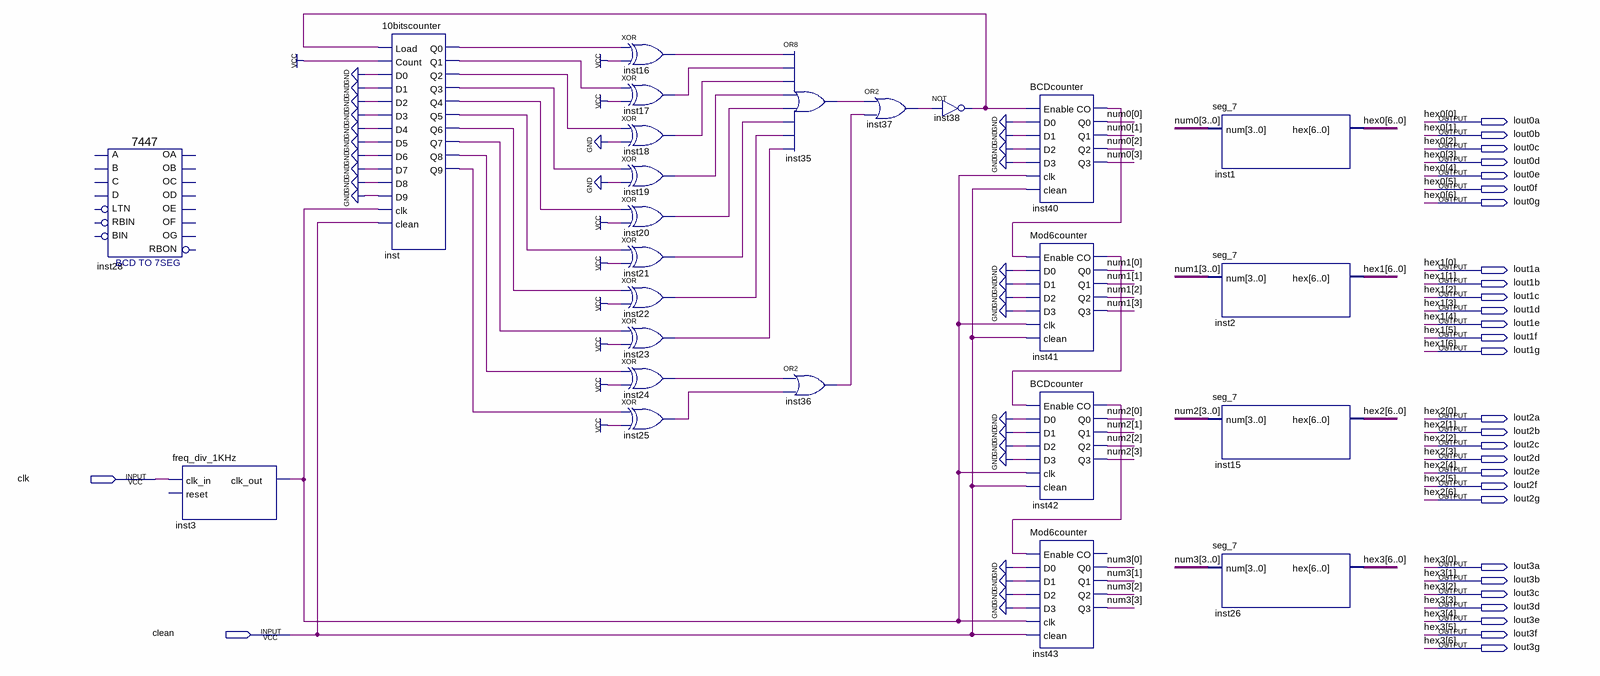
[diagram p0: schematic sheet]
// Quartus schematic Lab05.bdf as structural Verilog: 25 symbols, 30 pins
module Lab05 (
  input  clk,
  input  clean,
  output lout0a,
  output lout0b,
  output lout0c,
  output lout0d,
  output lout0e,
  output lout0f,
  output lout0g,
  output lout1a,
  output lout1b,
  output lout1c,
  output lout1d,
  output lout1e,
  output lout1f,
  output lout1g,
  output lout2a,
  output lout2b,
  output lout2c,
  output lout2d,
  output lout2e,
  output lout2f,
  output lout2g,
  output lout3a,
  output lout3b,
  output lout3c,
  output lout3d,
  output lout3e,
  output lout3f,
  output lout3g
);

  wire inst3_clk_out, inst16_out, inst17_out, inst18_out, inst19_out, inst20_out, inst21_out, inst22_out,
       inst23_out, inst24_out, inst25_out, inst35_out, inst36_out, inst37_out, inst38_out, inst40_co,
       inst41_co, inst42_co, inst_q0, inst_q1, inst_q2, inst_q3, inst_q4, inst_q5, inst_q6, inst_q7, inst_q8,
       inst_q9;
  wire [3:0] num0, num1, num2, num3;

  \7447  inst28 ();  // open: LTN, B, C, D, RBIN, BIN, A, OB, OC, OE, OD, OF, OG, OA, RBON
  freq_div_1KHz inst3 (.clk_in(clk), .clk_out(inst3_clk_out));  // open: reset
  \10bitscounter  inst (
    .Load(inst38_out), .Count(1'b1), .D0(1'b0), .D1(1'b0), .D2(1'b0), .D3(1'b0), .D4(1'b0), .D5(1'b0),
    .D6(1'b0), .D7(1'b0), .D8(1'b0), .D9(1'b0), .clk(inst3_clk_out), .clean(clean), .Q0(inst_q0),
    .Q1(inst_q1), .Q2(inst_q2), .Q3(inst_q3), .Q4(inst_q4), .Q5(inst_q5), .Q6(inst_q6), .Q7(inst_q7),
    .Q8(inst_q8), .Q9(inst_q9));
  xor inst16 (inst16_out, inst_q0, 1'b1);
  xor inst17 (inst17_out, inst_q1, 1'b1);
  xor inst18 (inst18_out, inst_q2, 1'b0);
  xor inst19 (inst19_out, inst_q3, 1'b0);
  xor inst20 (inst20_out, inst_q4, 1'b1);
  xor inst21 (inst21_out, inst_q5, 1'b1);
  xor inst22 (inst22_out, inst_q6, 1'b1);
  xor inst23 (inst23_out, inst_q7, 1'b1);
  xor inst24 (inst24_out, inst_q8, 1'b1);
  xor inst25 (inst25_out, inst_q9, 1'b1);
  or inst35 (inst35_out, inst16_out, inst17_out, inst18_out, inst19_out, inst20_out, inst21_out, inst22_out, inst23_out);
  or inst36 (inst36_out, inst24_out, inst25_out);
  or inst37 (inst37_out, inst35_out, inst36_out);
  not inst38 (inst38_out, inst37_out);
  BCDcounter inst40 (
    .Enable(inst38_out), .D0(1'b0), .D1(1'b0), .D2(1'b0), .D3(1'b0), .clk(inst3_clk_out), .clean(clean),
    .CO(inst40_co), .Q0(num0[0]), .Q1(num0[1]), .Q2(num0[2]), .Q3(num0[3]));
  Mod6counter inst41 (
    .Enable(inst40_co), .D0(1'b0), .D1(1'b0), .D2(1'b0), .D3(1'b0), .clk(inst3_clk_out), .clean(clean),
    .CO(inst41_co), .Q0(num1[0]), .Q1(num1[1]), .Q2(num1[2]), .Q3(num1[3]));
  BCDcounter inst42 (
    .Enable(inst41_co), .D0(1'b0), .D1(1'b0), .D2(1'b0), .D3(1'b0), .clk(inst3_clk_out), .clean(clean),
    .CO(inst42_co), .Q0(num2[0]), .Q1(num2[1]), .Q2(num2[2]), .Q3(num2[3]));
  Mod6counter inst43 (
    .Enable(inst42_co), .D0(1'b0), .D1(1'b0), .D2(1'b0), .D3(1'b0), .clk(inst3_clk_out), .clean(clean),
    .Q0(num3[0]), .Q1(num3[1]), .Q2(num3[2]), .Q3(num3[3]));  // open: CO
  seg_7 inst1 (.num(num0), .hex({lout0g, lout0f, lout0e, lout0d, lout0c, lout0b, lout0a}));
  seg_7 inst2 (.num(num1), .hex({lout1g, lout1f, lout1e, lout1d, lout1c, lout1b, lout1a}));
  seg_7 inst15 (.num(num2), .hex({lout2g, lout2f, lout2e, lout2d, lout2c, lout2b, lout2a}));
  seg_7 inst26 (.num(num3), .hex({lout3g, lout3f, lout3e, lout3d, lout3c, lout3b, lout3a}));

  // Other names for the same wires on the sheet: hex0[6:0] = {lout0g, lout0f, lout0e, lout0d, lout0c, lout0b, lout0a};
  //   hex1[6:0] = {lout1g, lout1f, lout1e, lout1d, lout1c, lout1b, lout1a};
  //   hex2[6:0] = {lout2g, lout2f, lout2e, lout2d, lout2c, lout2b, lout2a};
  //   hex3[6:0] = {lout3g, lout3f, lout3e, lout3d, lout3c, lout3b, lout3a}
endmodule
